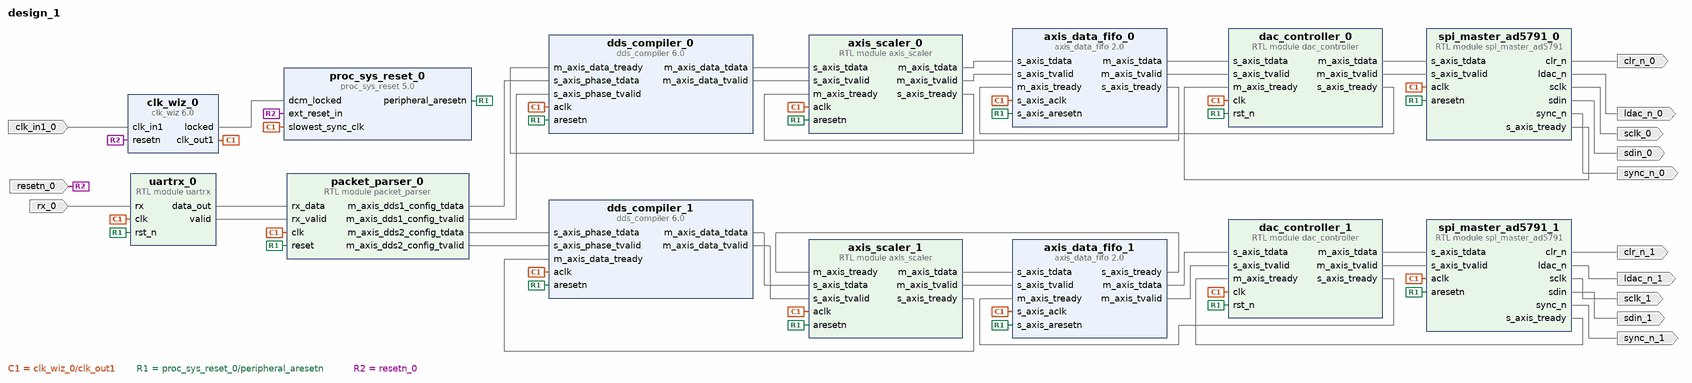
[diagram p0: block diagram of the top level]
# Vivado block design design_1, xc7a100tcsg324-1, Vivado 2023.2
create_bd_design design_1

create_bd_port -dir O sclk_0
create_bd_port -dir O sdin_0
create_bd_port -dir O sync_n_0
create_bd_port -dir O ldac_n_0
create_bd_port -dir O clr_n_0
create_bd_port -dir I rx_0
create_bd_port -dir I -type clk clk_in1_0
create_bd_port -dir O sclk_1
create_bd_port -dir O sdin_1
create_bd_port -dir O sync_n_1
create_bd_port -dir O ldac_n_1
create_bd_port -dir O clr_n_1
create_bd_port -dir I -type rst resetn_0

create_bd_cell -type ip -vlnv xilinx.com:ip:dds_compiler:6.0 dds_compiler_0
set_property -dict [list \
  CONFIG.DATA_Has_TLAST Not_Required \
  CONFIG.Has_ARESETn true \
  CONFIG.Has_Phase_Out false \
  CONFIG.Has_TREADY true \
  CONFIG.Latency 15 \
  CONFIG.M_DATA_Has_TUSER Not_Required \
  CONFIG.Noise_Shaping Taylor_Series_Corrected \
  CONFIG.Output_Frequency1 0 \
  CONFIG.Output_Selection Sine \
  CONFIG.Output_Width 20 \
  CONFIG.PINC1 0 \
  CONFIG.Parameter_Entry Hardware_Parameters \
  CONFIG.Phase_Increment Streaming \
  CONFIG.Phase_Width 32 \
  CONFIG.Phase_offset Streaming \
  CONFIG.S_PHASE_Has_TUSER Not_Required \
] [get_bd_cells dds_compiler_0]
create_bd_cell -type module -reference axis_scaler axis_scaler_0
create_bd_cell -type module -reference dac_controller dac_controller_0
create_bd_cell -type module -reference packet_parser packet_parser_0
create_bd_cell -type module -reference spi_master_ad5791 spi_master_ad5791_0
create_bd_cell -type module -reference uartrx uartrx_0
create_bd_cell -type ip -vlnv xilinx.com:ip:axis_data_fifo:2.0 axis_data_fifo_0
set_property -dict {CONFIG.TDATA_NUM_BYTES 4} [get_bd_cells axis_data_fifo_0]
create_bd_cell -type ip -vlnv xilinx.com:ip:clk_wiz:6.0 clk_wiz_0
set_property -dict {CONFIG.RESET_PORT resetn CONFIG.RESET_TYPE ACTIVE_LOW} [get_bd_cells clk_wiz_0]
create_bd_cell -type ip -vlnv xilinx.com:ip:proc_sys_reset:5.0 proc_sys_reset_0
create_bd_cell -type ip -vlnv xilinx.com:ip:dds_compiler:6.0 dds_compiler_1
set_property -dict [list \
  CONFIG.DATA_Has_TLAST Not_Required \
  CONFIG.Has_ARESETn true \
  CONFIG.Has_Phase_Out false \
  CONFIG.Has_TREADY true \
  CONFIG.Latency 15 \
  CONFIG.M_DATA_Has_TUSER Not_Required \
  CONFIG.Noise_Shaping Taylor_Series_Corrected \
  CONFIG.Output_Frequency1 0 \
  CONFIG.Output_Selection Sine \
  CONFIG.Output_Width 20 \
  CONFIG.PINC1 0 \
  CONFIG.Parameter_Entry Hardware_Parameters \
  CONFIG.Phase_Increment Streaming \
  CONFIG.Phase_Width 32 \
  CONFIG.Phase_offset Streaming \
  CONFIG.S_PHASE_Has_TUSER Not_Required \
] [get_bd_cells dds_compiler_1]
create_bd_cell -type module -reference axis_scaler axis_scaler_1
create_bd_cell -type ip -vlnv xilinx.com:ip:axis_data_fifo:2.0 axis_data_fifo_1
set_property -dict {CONFIG.TDATA_NUM_BYTES 4} [get_bd_cells axis_data_fifo_1]
create_bd_cell -type module -reference dac_controller dac_controller_1
create_bd_cell -type module -reference spi_master_ad5791 spi_master_ad5791_1

# ---- connections ----

connect_bd_net [get_bd_pins clk_wiz_0/clk_out1] \
  [get_bd_pins proc_sys_reset_0/slowest_sync_clk] [get_bd_pins dds_compiler_0/aclk] \
  [get_bd_pins axis_data_fifo_0/s_axis_aclk] [get_bd_pins axis_data_fifo_1/s_axis_aclk] [get_bd_pins dds_compiler_1/aclk] \
  [get_bd_pins spi_master_ad5791_0/aclk] [get_bd_pins spi_master_ad5791_1/aclk] [get_bd_pins packet_parser_0/clk] \
  [get_bd_pins axis_scaler_0/aclk] [get_bd_pins axis_scaler_1/aclk] [get_bd_pins uartrx_0/clk] \
  [get_bd_pins dac_controller_0/clk] [get_bd_pins dac_controller_1/clk]
connect_bd_net [get_bd_pins axis_data_fifo_0/m_axis_tdata] [get_bd_pins dac_controller_0/s_axis_tdata]
connect_bd_net [get_bd_pins axis_data_fifo_0/m_axis_tvalid] [get_bd_pins dac_controller_0/s_axis_tvalid]
connect_bd_net [get_bd_pins axis_data_fifo_0/s_axis_tready] [get_bd_pins axis_scaler_0/m_axis_tready]
connect_bd_net [get_bd_pins axis_data_fifo_1/m_axis_tdata] [get_bd_pins dac_controller_1/s_axis_tdata]
connect_bd_net [get_bd_pins axis_data_fifo_1/m_axis_tvalid] [get_bd_pins dac_controller_1/s_axis_tvalid]
connect_bd_net [get_bd_pins axis_data_fifo_1/s_axis_tready] [get_bd_pins axis_scaler_1/m_axis_tready]
connect_bd_net [get_bd_pins axis_scaler_0/m_axis_tdata] [get_bd_pins axis_data_fifo_0/s_axis_tdata]
connect_bd_net [get_bd_pins axis_scaler_0/m_axis_tvalid] [get_bd_pins axis_data_fifo_0/s_axis_tvalid]
connect_bd_net [get_bd_pins axis_scaler_0/s_axis_tready] [get_bd_pins dds_compiler_0/m_axis_data_tready]
connect_bd_net [get_bd_pins axis_scaler_1/m_axis_tdata] [get_bd_pins axis_data_fifo_1/s_axis_tdata]
connect_bd_net [get_bd_pins axis_scaler_1/m_axis_tvalid] [get_bd_pins axis_data_fifo_1/s_axis_tvalid]
connect_bd_net [get_bd_pins axis_scaler_1/s_axis_tready] [get_bd_pins dds_compiler_1/m_axis_data_tready]
connect_bd_net -net clk_in1_0_1 [get_bd_ports clk_in1_0] [get_bd_pins clk_wiz_0/clk_in1]
connect_bd_net [get_bd_pins clk_wiz_0/locked] [get_bd_pins proc_sys_reset_0/dcm_locked]
connect_bd_net [get_bd_pins dac_controller_0/m_axis_tdata] [get_bd_pins spi_master_ad5791_0/s_axis_tdata]
connect_bd_net [get_bd_pins dac_controller_0/m_axis_tvalid] [get_bd_pins spi_master_ad5791_0/s_axis_tvalid]
connect_bd_net [get_bd_pins dac_controller_0/s_axis_tready] [get_bd_pins axis_data_fifo_0/m_axis_tready]
connect_bd_net [get_bd_pins dac_controller_1/m_axis_tdata] [get_bd_pins spi_master_ad5791_1/s_axis_tdata]
connect_bd_net [get_bd_pins dac_controller_1/m_axis_tvalid] [get_bd_pins spi_master_ad5791_1/s_axis_tvalid]
connect_bd_net [get_bd_pins dac_controller_1/s_axis_tready] [get_bd_pins axis_data_fifo_1/m_axis_tready]
connect_bd_net [get_bd_pins dds_compiler_0/m_axis_data_tdata] [get_bd_pins axis_scaler_0/s_axis_tdata]
connect_bd_net [get_bd_pins dds_compiler_0/m_axis_data_tvalid] [get_bd_pins axis_scaler_0/s_axis_tvalid]
connect_bd_net [get_bd_pins dds_compiler_1/m_axis_data_tdata] [get_bd_pins axis_scaler_1/s_axis_tdata]
connect_bd_net [get_bd_pins dds_compiler_1/m_axis_data_tvalid] [get_bd_pins axis_scaler_1/s_axis_tvalid]
connect_bd_net [get_bd_pins packet_parser_0/m_axis_dds2_config_tdata] [get_bd_pins dds_compiler_1/s_axis_phase_tdata]
connect_bd_net [get_bd_pins packet_parser_0/m_axis_dds2_config_tvalid] [get_bd_pins dds_compiler_1/s_axis_phase_tvalid]
connect_bd_net -net packet_parser_0_m_axis_dds_config_tdata [get_bd_pins packet_parser_0/m_axis_dds1_config_tdata] \
  [get_bd_pins dds_compiler_0/s_axis_phase_tdata]
connect_bd_net -net packet_parser_0_m_axis_dds_config_tvalid [get_bd_pins packet_parser_0/m_axis_dds1_config_tvalid] \
  [get_bd_pins dds_compiler_0/s_axis_phase_tvalid]
connect_bd_net [get_bd_pins proc_sys_reset_0/peripheral_aresetn] \
  [get_bd_pins dds_compiler_0/aresetn] [get_bd_pins axis_data_fifo_0/s_axis_aresetn] \
  [get_bd_pins axis_data_fifo_1/s_axis_aresetn] [get_bd_pins dds_compiler_1/aresetn] \
  [get_bd_pins spi_master_ad5791_0/aresetn] [get_bd_pins spi_master_ad5791_1/aresetn] [get_bd_pins packet_parser_0/reset] \
  [get_bd_pins axis_scaler_0/aresetn] [get_bd_pins axis_scaler_1/aresetn] [get_bd_pins uartrx_0/rst_n] \
  [get_bd_pins dac_controller_0/rst_n] [get_bd_pins dac_controller_1/rst_n]
connect_bd_net -net resetn_0_1 [get_bd_ports resetn_0] [get_bd_pins clk_wiz_0/resetn] [get_bd_pins proc_sys_reset_0/ext_reset_in]
connect_bd_net -net rx_0_1 [get_bd_ports rx_0] [get_bd_pins uartrx_0/rx]
connect_bd_net [get_bd_pins spi_master_ad5791_0/clr_n] [get_bd_ports clr_n_0]
connect_bd_net [get_bd_pins spi_master_ad5791_0/ldac_n] [get_bd_ports ldac_n_0]
connect_bd_net [get_bd_pins spi_master_ad5791_0/s_axis_tready] [get_bd_pins dac_controller_0/m_axis_tready]
connect_bd_net [get_bd_pins spi_master_ad5791_0/sclk] [get_bd_ports sclk_0]
connect_bd_net [get_bd_pins spi_master_ad5791_0/sdin] [get_bd_ports sdin_0]
connect_bd_net [get_bd_pins spi_master_ad5791_0/sync_n] [get_bd_ports sync_n_0]
connect_bd_net [get_bd_pins spi_master_ad5791_1/clr_n] [get_bd_ports clr_n_1]
connect_bd_net [get_bd_pins spi_master_ad5791_1/ldac_n] [get_bd_ports ldac_n_1]
connect_bd_net [get_bd_pins spi_master_ad5791_1/s_axis_tready] [get_bd_pins dac_controller_1/m_axis_tready]
connect_bd_net [get_bd_pins spi_master_ad5791_1/sclk] [get_bd_ports sclk_1]
connect_bd_net [get_bd_pins spi_master_ad5791_1/sdin] [get_bd_ports sdin_1]
connect_bd_net [get_bd_pins spi_master_ad5791_1/sync_n] [get_bd_ports sync_n_1]
connect_bd_net [get_bd_pins uartrx_0/data_out] [get_bd_pins packet_parser_0/rx_data]
connect_bd_net [get_bd_pins uartrx_0/valid] [get_bd_pins packet_parser_0/rx_valid]

validate_bd_design
save_bd_design
